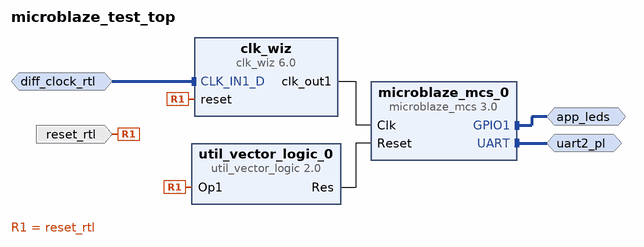
[diagram p0: block diagram of the top level]
# Vivado block design microblaze_test_top, xczu29dr-ffvf1760-2-e, Vivado 2019.1
create_bd_design microblaze_test_top

create_bd_intf_port -mode Master -vlnv xilinx.com:interface:uart_rtl:1.0 uart2_pl
create_bd_intf_port -mode Master -vlnv xilinx.com:interface:gpio_rtl:1.0 app_leds
create_bd_intf_port -mode Slave -vlnv xilinx.com:interface:diff_clock_rtl:1.0 diff_clock_rtl
set_property -dict {CONFIG.FREQ_HZ 300000000} [get_bd_intf_ports diff_clock_rtl]
create_bd_port -dir I -type rst reset_rtl
set_property -dict {CONFIG.POLARITY ACTIVE_HIGH} [get_bd_ports reset_rtl]

create_bd_cell -type ip -vlnv xilinx.com:ip:microblaze_mcs:3.0 microblaze_mcs_0
set_property -dict [list \
  CONFIG.DEBUG_ENABLED 2 \
  CONFIG.GPIO1_BOARD_INTERFACE app_leds \
  CONFIG.JTAG_CHAIN 1 \
  CONFIG.MEMSIZE 131072 \
  CONFIG.UART_BAUDRATE 115200 \
  CONFIG.UART_BOARD_INTERFACE uart2_pl \
  CONFIG.UART_ERROR_INTERRUPT 1 \
  CONFIG.UART_RX_INTERRUPT 1 \
  CONFIG.UART_TX_INTERRUPT 1 \
  CONFIG.USE_BOARD_FLOW true \
] [get_bd_cells microblaze_mcs_0]
create_bd_cell -type ip -vlnv xilinx.com:ip:clk_wiz:6.0 clk_wiz
set_property -dict [list \
  CONFIG.CLKIN1_JITTER_PS 33.330000000000005 \
  CONFIG.CLKOUT1_JITTER 101.475 \
  CONFIG.CLKOUT1_PHASE_ERROR 77.836 \
  CONFIG.MMCM_CLKFBOUT_MULT_F 4.000 \
  CONFIG.MMCM_CLKIN1_PERIOD 3.333 \
  CONFIG.MMCM_CLKIN2_PERIOD 10.0 \
  CONFIG.PRIM_IN_FREQ 300.000 \
  CONFIG.PRIM_SOURCE Differential_clock_capable_pin \
  CONFIG.RESET_PORT reset \
  CONFIG.RESET_TYPE ACTIVE_HIGH \
  CONFIG.USE_LOCKED false \
] [get_bd_cells clk_wiz]
create_bd_cell -type ip -vlnv xilinx.com:ip:util_vector_logic:2.0 util_vector_logic_0
set_property -dict {CONFIG.C_OPERATION not CONFIG.C_SIZE 1} [get_bd_cells util_vector_logic_0]

# ---- connections ----

connect_bd_intf_net [get_bd_intf_ports diff_clock_rtl] [get_bd_intf_pins clk_wiz/CLK_IN1_D]
connect_bd_intf_net [get_bd_intf_ports uart2_pl] [get_bd_intf_pins microblaze_mcs_0/UART]
connect_bd_intf_net [get_bd_intf_ports app_leds] [get_bd_intf_pins microblaze_mcs_0/GPIO1]
connect_bd_net [get_bd_pins clk_wiz/clk_out1] [get_bd_pins microblaze_mcs_0/Clk]
connect_bd_net [get_bd_ports reset_rtl] [get_bd_pins util_vector_logic_0/Op1] [get_bd_pins clk_wiz/reset]
connect_bd_net [get_bd_pins util_vector_logic_0/Res] [get_bd_pins microblaze_mcs_0/Reset]

validate_bd_design
save_bd_design
